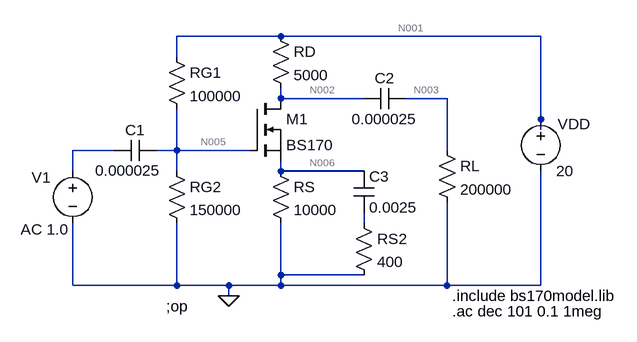
[diagram p0: schematic Draft2.asc]
Draft2.asc, the LTspice schematic file:
Version 4
SHEET 1 880 680
WIRE 208 -16 48 -16
WIRE 608 -16 208 -16
WIRE 48 16 48 -16
WIRE 208 80 208 64
WIRE 336 80 208 80
WIRE 464 80 400 80
WIRE 608 112 608 -16
WIRE 608 128 608 112
WIRE -48 160 -112 160
WIRE 48 160 48 96
WIRE 48 160 16 160
WIRE 160 160 48 160
WIRE 464 160 464 80
WIRE -112 192 -112 160
WIRE 48 192 48 160
WIRE 208 192 208 176
WIRE 336 192 208 192
WIRE 336 272 336 256
WIRE 208 352 208 272
WIRE 336 352 208 352
WIRE -112 368 -112 272
WIRE 48 368 48 272
WIRE 48 368 -112 368
WIRE 128 368 48 368
WIRE 208 368 208 352
WIRE 208 368 128 368
WIRE 464 368 464 240
WIRE 464 368 208 368
WIRE 608 368 608 192
WIRE 608 368 464 368
WIRE 128 384 128 368
FLAG 128 384 0
DATAFLAG 336 -16 ""
SYMBOL nmos 160 80 R0
SYMATTR InstName M1
SYMATTR Value BS170
SYMBOL res 32 176 R0
SYMATTR InstName RG2
SYMATTR Value 150000
SYMBOL res 32 0 R0
SYMATTR InstName RG1
SYMATTR Value 100000
SYMBOL res 192 -32 R0
SYMATTR InstName RD
SYMATTR Value 5000
SYMBOL res 192 176 R0
SYMATTR InstName RS
SYMATTR Value 10000
SYMBOL voltage 608 96 R0
WINDOW 123 0 0 Left 0
WINDOW 39 0 0 Left 0
WINDOW 0 26 23 Left 2
SYMATTR InstName VDD
SYMATTR Value 20
SYMBOL res 448 144 R0
SYMATTR InstName RL
SYMATTR Value 200000
SYMBOL cap 16 144 R90
WINDOW 0 0 32 VBottom 2
WINDOW 3 31 43 VTop 2
SYMATTR InstName C1
SYMATTR Value 0.000025
SYMBOL cap 400 64 R90
WINDOW 0 0 32 VBottom 2
WINDOW 3 32 32 VTop 2
SYMATTR InstName C2
SYMATTR Value 0.000025
SYMBOL voltage -112 176 R0
WINDOW 0 -63 26 Left 2
WINDOW 3 -60 78 Left 2
WINDOW 123 -80 106 Left 2
WINDOW 39 0 0 Left 0
SYMATTR InstName V1
SYMATTR Value ""
SYMATTR Value2 AC 1.0
SYMBOL cap 320 192 R0
SYMATTR InstName C3
SYMATTR Value 0.0025
SYMBOL res 320 256 R0
SYMATTR InstName RS2
SYMATTR Value 400
TEXT 472 384 Left 2 !.include bs170model.lib
TEXT 32 400 Left 2 !;op
TEXT 472 408 Left 2 !.ac dec 101 0.1 1meg

The netlist it stands for:
* Draft2.asc
M1 N002 N005 N006 N006 BS170
RG2 N005 0 150000
RG1 N001 N005 100000
RD N001 N002 5000
RS N006 0 10000
VDD N001 0 20
RL N003 0 200000
C1 N005 N004 0.000025
C2 N003 N002 0.000025
V1 N004 0 AC 1.0
C3 N006 N007 0.0025
RS2 N007 0 400
.model NMOS NMOS
.model PMOS PMOS
.lib standard.mos
.include bs170model.lib
;op
.ac dec 101 0.1 1meg
.backanno
.end

* Results of the author's LTspice run, read from the files saved beside the schematic
* Operating Point, zero values left out:
*   V(n002) = 15.17 V
*   V(n005) = 12 V
*   V(n006) = 9.65 V
*   V(n001) = 20 V
*   Id(M1) = 965.6 µA
*   Ib(M1) = -5.535 pA
*   Is(M1) = -965.6 µA
*   I(Rs) = 965 µA
*   I(Rd) = 965 µA
*   I(Rg1) = 80 µA
*   I(Rg2) = 80 µA
*   I(Vdd) = -1.045 mA
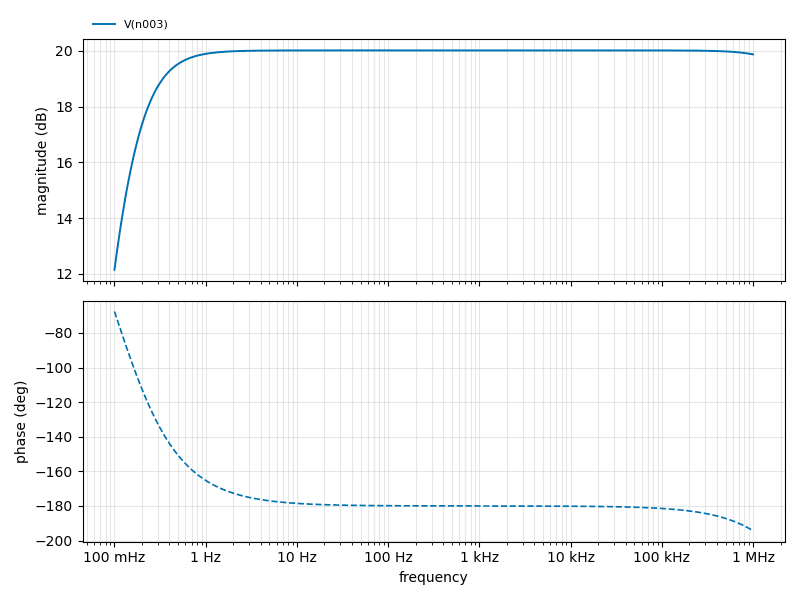
[diagram p1: AC Analysis of Draft2.asc, plotted from the saved traces]
* AC Analysis, 1 run:
*   V(n003): 12.15 dB at 100 mHz, 19.87 dB at 1 MHz, peak 20.01 dB at 955.4 Hz, 3 dB below the peak at 186.2 mHz